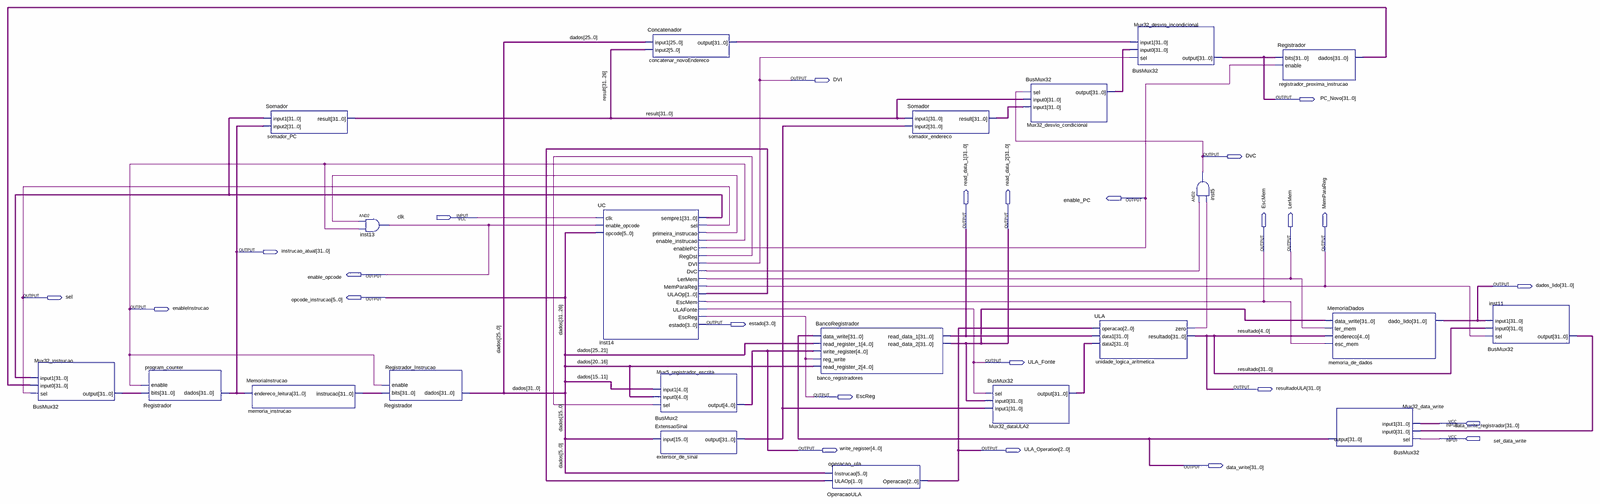
[diagram p0: schematic sheet, whole]
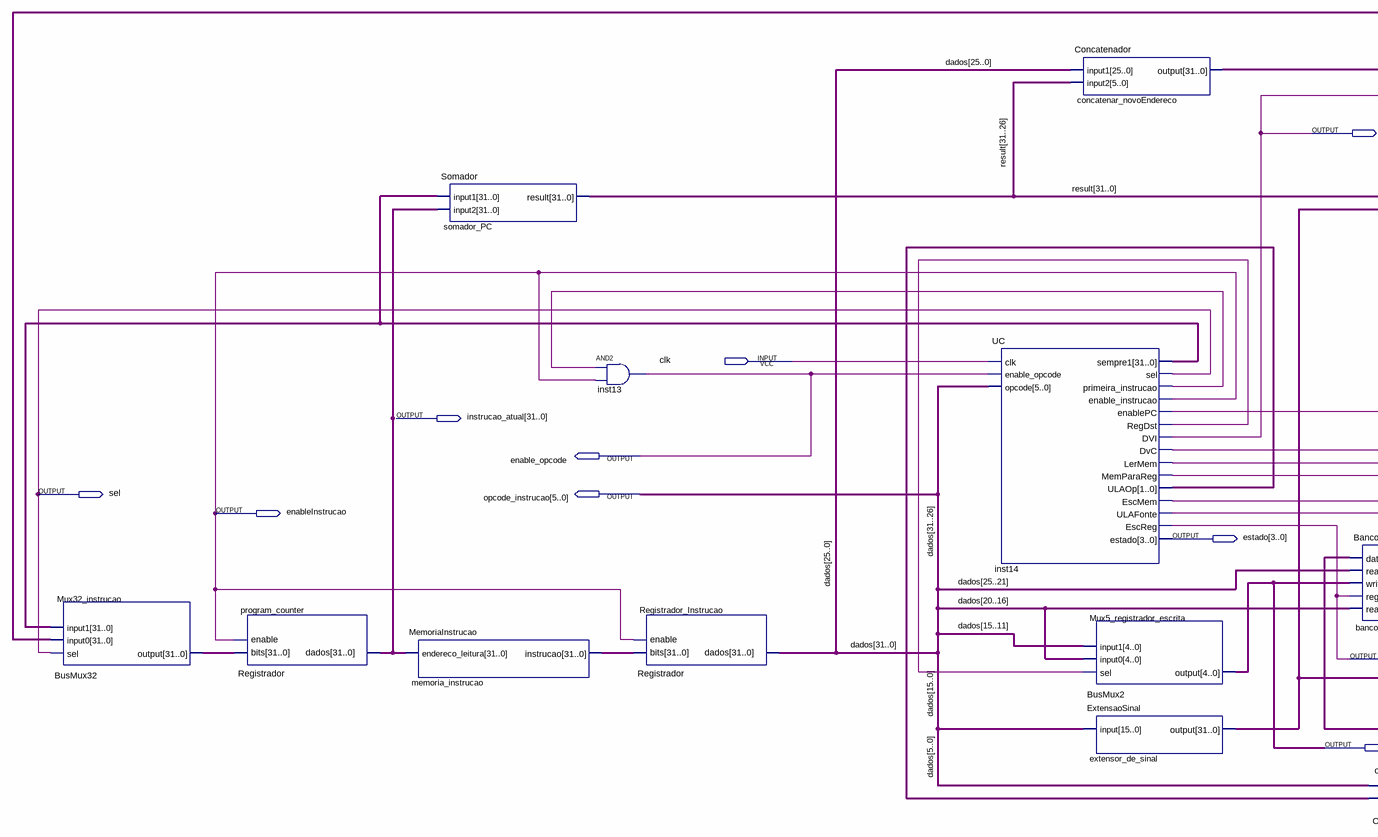
[diagram p1: schematic sheet, left part]
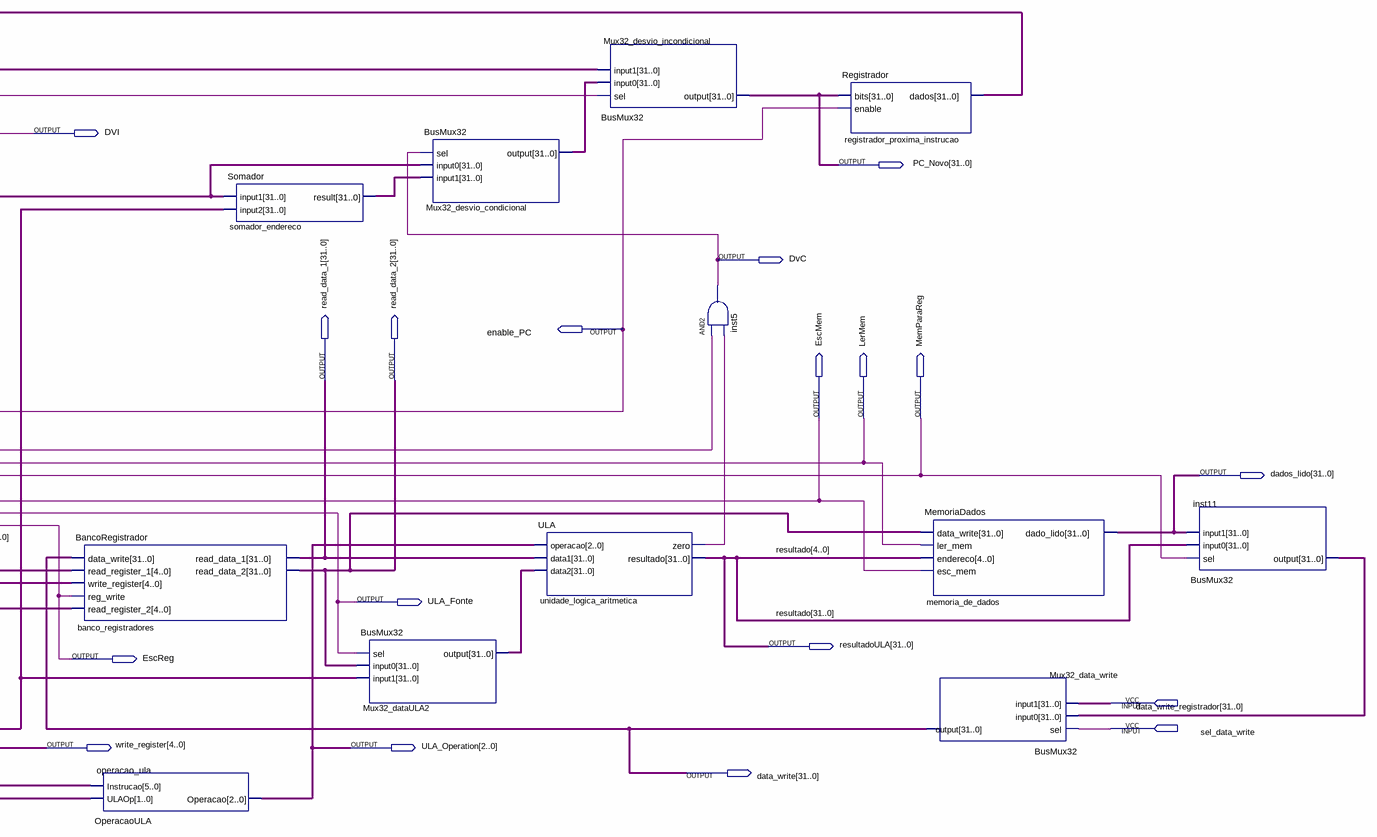
[diagram p2: schematic sheet, right part]
// Quartus schematic Processador.bdf as structural Verilog: 22 symbols, 25 pins
module Processador (
  input  clk,
  input  [31:0] data_write_registrador,
  input  sel_data_write,
  output DVI,
  output [31:0] PC_Novo,
  output DvC,
  output enable_PC,
  output [31:0] read_data_1,
  output [31:0] read_data_2,
  output [31:0] instrucao_atual,
  output EscMem,
  output LerMem,
  output MemParaReg,
  output enable_opcode,
  output [31:0] dados_lido,
  output sel,
  output [5:0] opcode_instrucao,
  output enableInstrucao,
  output [3:0] estado,
  output ULA_Fonte,
  output [31:0] resultadoULA,
  output EscReg,
  output [4:0] write_register,
  output [2:0] ULA_Operation,
  output [31:0] data_write
);

  wire inst14_dvc, inst14_primeira_instrucao, inst14_regdst, unidade_logica_aritmetica_zero;
  wire [1:0] inst14_ulaop;
  wire [25:0] dados;
  wire [31:0] concatenar_novoEndereco_output, extensor_de_sinal_output, inst11_output, inst14_sempre1,
       memoria_instrucao_instrucao, Mux32_dataULA2_output, Mux32_desvio_condicional_output,
       Mux32_instrucao_output, registrador_proxima_instrucao_dados, result, somador_endereco_result;

  BusMux32 Mux32_instrucao (
    .sel(sel), .input0(registrador_proxima_instrucao_dados), .input1(inst14_sempre1),
    .\output (Mux32_instrucao_output));
  Registrador program_counter (.bits(Mux32_instrucao_output), .enable(enableInstrucao), .dados(instrucao_atual));
  Somador somador_PC (.input1(inst14_sempre1), .input2(instrucao_atual), .result(result));
  MemoriaInstrucao memoria_instrucao (.endereco_leitura(instrucao_atual), .instrucao(memoria_instrucao_instrucao));
  and inst13 (enable_opcode, inst14_primeira_instrucao, enableInstrucao);
  Registrador Registrador_Instrucao (
    .bits(memoria_instrucao_instrucao), .enable(enableInstrucao), .dados({opcode_instrucao, dados}));
  UC inst14 (
    .clk(clk), .enable_opcode(enable_opcode), .opcode(opcode_instrucao), .sempre1(inst14_sempre1), .sel(sel),
    .primeira_instrucao(inst14_primeira_instrucao), .enable_instrucao(enableInstrucao), .enablePC(enable_PC),
    .RegDst(inst14_regdst), .DVI(DVI), .DvC(inst14_dvc), .LerMem(LerMem), .MemParaReg(MemParaReg),
    .ULAOp(inst14_ulaop), .EscMem(EscMem), .ULAFonte(ULA_Fonte), .EscReg(EscReg), .estado(estado));
  Concatenador concatenar_novoEndereco (
    .input1(dados), .input2(result[31:26]), .\output (concatenar_novoEndereco_output));
  BusMux2 Mux5_registrador_escrita (
    .sel(inst14_regdst), .input0(dados[20:16]), .input1(dados[15:11]), .\output (write_register));
  ExtensaoSinal extensor_de_sinal (.\input (dados[15:0]), .\output (extensor_de_sinal_output));
  BancoRegistrador banco_registradores (
    .data_write(data_write), .read_register_1(dados[25:21]), .write_register(write_register),
    .reg_write(EscReg), .read_register_2(dados[20:16]), .read_data_1(read_data_1), .read_data_2(read_data_2));
  OperacaoULA operacao_ula (.ULAOp(inst14_ulaop), .Instrucao(dados[5:0]), .Operacao(ULA_Operation));
  Somador somador_endereco (.input1(result), .input2(extensor_de_sinal_output), .result(somador_endereco_result));
  BusMux32 Mux32_dataULA2 (
    .sel(ULA_Fonte), .input0(read_data_2), .input1(extensor_de_sinal_output), .\output (Mux32_dataULA2_output));
  BusMux32 Mux32_desvio_condicional (
    .sel(DvC), .input0(result), .input1(somador_endereco_result), .\output (Mux32_desvio_condicional_output));
  ULA unidade_logica_aritmetica (
    .operacao(ULA_Operation), .data1(read_data_1), .data2(Mux32_dataULA2_output),
    .zero(unidade_logica_aritmetica_zero), .resultado(resultadoULA));
  BusMux32 Mux32_desvio_incondicional (
    .sel(DVI), .input0(Mux32_desvio_condicional_output), .input1(concatenar_novoEndereco_output),
    .\output (PC_Novo));
  and inst5 (DvC, inst14_dvc, unidade_logica_aritmetica_zero);
  Registrador registrador_proxima_instrucao (
    .bits(PC_Novo), .enable(enable_PC), .dados(registrador_proxima_instrucao_dados));
  MemoriaDados memoria_de_dados (
    .data_write(read_data_2), .ler_mem(LerMem), .endereco(resultadoULA[4:0]), .esc_mem(EscMem),
    .dado_lido(dados_lido));
  BusMux32 Mux32_data_write (
    .sel(sel_data_write), .input0(inst11_output), .input1(data_write_registrador), .\output (data_write));
  BusMux32 inst11 (.sel(MemParaReg), .input0(resultadoULA), .input1(dados_lido), .\output (inst11_output));

  // Other names for the same wires on the sheet: dados[31:26] = opcode_instrucao; resultado[31:0] = resultadoULA
endmodule
